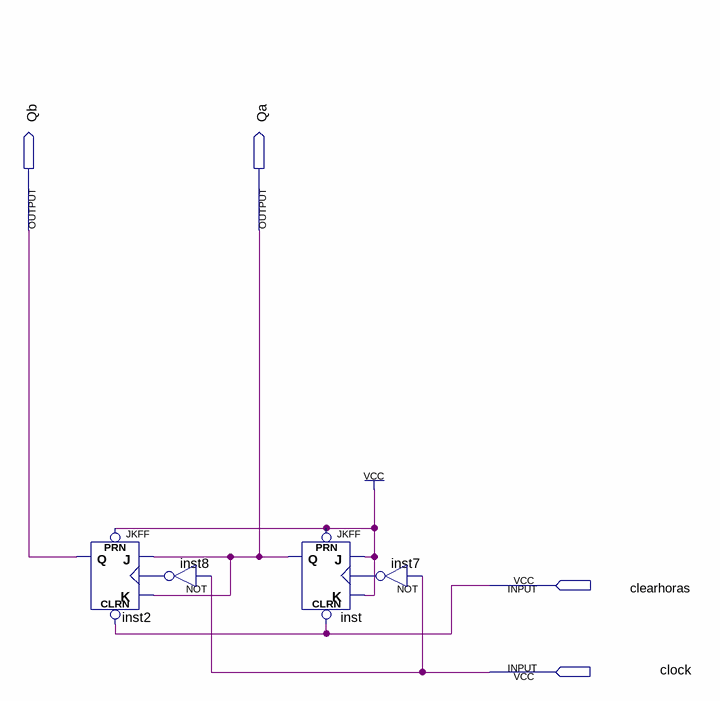
[diagram p0: schematic sheet]
// Quartus schematic Conthoras.bdf as structural Verilog: 4 symbols, 4 pins
module Conthoras (
  input  clearhoras,
  input  clock,
  output Qb,
  output Qa
);

  wire inst7_out, inst8_out;

  JKFF inst2 (.PRN(1'b1), .CLRN(clearhoras), .K(Qa), .J(Qa), .CLK(inst8_out), .Q(Qb));
  not inst8 (inst8_out, clock);
  JKFF inst (.PRN(1'b1), .CLRN(clearhoras), .K(1'b1), .J(1'b1), .CLK(inst7_out), .Q(Qa));
  not inst7 (inst7_out, clock);
endmodule
